# Altium schematic sheet LM5146.SchDoc
size A4; SheetNumber: 2; SheetTotal: 3
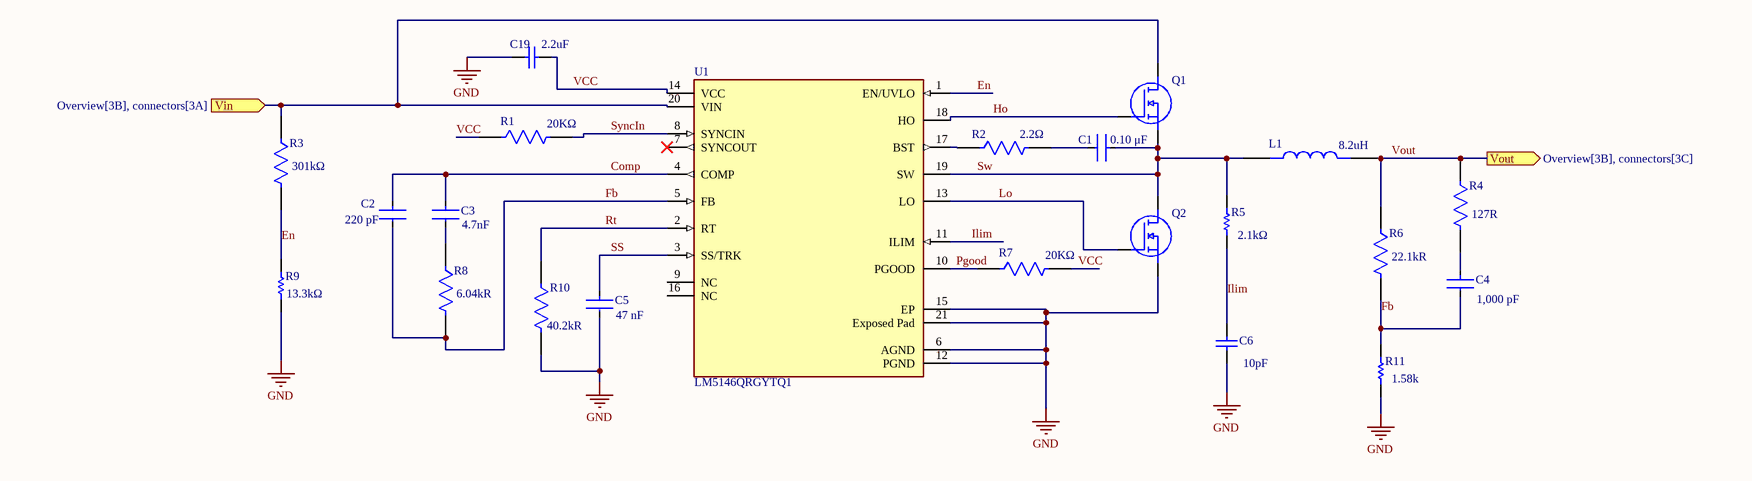
[diagram p0: LM5146.SchDoc]

## Parts
C1  value 0.10 μF  [FP-C0805C-DN-MFG]  (hidden comment: C0805C104K5RACTU)
C2  Capacitance: 220 pF  [FP-CC0805-0_85-MFG]  (hidden comment: CC0805KRX7R9BB221)
C3  Capacitance: 4.7nF  [FP-GRM216-0_1-IPC_C]  (hidden comment: GRM2165C1H472JA01D)
C4  value 1,000 pF  [FP-C0805C-DN-MFG]  (hidden comment: C0805C102J5GACTU)
C5  Capacitance: 47 nF  [FP-C0805C-DN-MFG]  (hidden comment: C0805C473K5RACTU)
C6  capacitance: 10pF  [CAPC2013X88X50ML20T25]  (hidden comment: C0805C100JDGACTU)
C19  Capacitance: 2.2uF  [CAPC2013X135X50ML10T20]  (hidden comment: GRM21BR71A225KA01L)
L1  value 8.2uH  [CPRX3231L-8R2MC]  (hidden comment: CPRX3231L-8R2MC)
Q1  STP130N6F7  [TO255P460X1020X2008-3P]  (value not drawn)
Q2  STP130N6F7  [TO255P460X1020X2008-3P]  (value not drawn)
R1  Resistance: 20KΩ  [FP-RN732A-MFG]  (hidden comment: RN73C2A20KBTDF)
R2  Resistance: 2.2Ω  [FP-RMCF0805-IPC_A]  (hidden comment: RMCF0805JT2R20)
R3  Resistance: 301kΩ  [FP-RMCF0805-IPC_A]  (hidden comment: RMCF0805FT301K)
R4  Resistance: 127R  [FP-CRCW0805-e3-IPC_C]  (hidden comment: CRCW0805127RFKEA)
R5  Resistance: 2.1kΩ  [RESC2013X60X30NL20T20]  (hidden comment: RK73H2ATTD2101F)
R6  Resistance: 22.1kR  [FP-RMCF0805-IPC_B]  (hidden comment: RMCF0805FT22K1)
R7  Resistance: 20KΩ  [FP-RN732A-MFG]  (hidden comment: RN73C2A20KBTDF)
R8  Resistance: 6.04kR  [FP-RMCF0805-IPC_B]  (hidden comment: RMCF0805FT6K04)
R9  Resistance: 13.3kΩ  [RESC2013X60X35ML10T20]  (hidden comment: RC0805FR-0713K3L)
R10  Resistance: 40.2kR  [FP-RMCF0805-IPC_C]  (hidden comment: RMCF0805FT40K2)
R11  Resistance: 1.58k  [RESC2013X60X35LL10T20]  (hidden comment: RC0805FR-071K58L)
U1  LM5146QRGYTQ1  [FP-RGY0020B-MFG]

## Ports
Vin (in, see Overview[3B], connectors[3A]), Vout (out, see Overview[3B], connectors[3C])

## Nets
GND: C5.2 C6.2 C19.1 Q2.3(S) R9.2 R10.2 R11.2 U1.6(AGND) U1.12(PGND) U1.15(EP) U1.21(Exposed_Pad)
Comp: C2.1 C3.2 U1.4(COMP)
En: R3.2 R9.1 U1.1(EN/UVLO)
Fb: C2.2 C4.2 R6.2 R8.2 R11.1 U1.5(FB)
Ho: Q1.1(G) U1.18(HO)
Ilim: C6.1 R5.2 U1.11(ILIM)
Lo: Q2.1(G) U1.13(LO)
Pgood: R7.1 U1.10(PGOOD)
Rt: R10.1 U1.2(RT)
SS: C5.1 U1.3(SS/TRK)
Sw: C1.1 L1.1 Q1.3(S) Q2.2(D) R5.1 U1.19(SW)
SyncIn: R1.2 U1.8(SYNCIN)
VCC: C19.2 R1.1 R7.2 U1.14(VCC)
Vin: Q1.2(D) R3.1 U1.20(VIN) ; port Vin
Vout: L1.2 R4.1 R6.1 ; port Vout
NetC1_2: C1.2 R2.2
NetC3_1: C3.1 R8.1
NetC4_1: C4.1 R4.2
NetR2_1: R2.1 U1.17(BST)

Not connected (* = marked no-connect by the designer): U1 7(SYNCOUT)* 9(NC) 16(NC)

## Library data of the parts
C1 = CMP-2007-00279-2: CAP CER 0.1UF 50V X7R 0805; Manufacturer: KEMET; Description: C0805 0.10 μF X7R 30ppm/°C 10.00% 50 V; Tolerance: 0.1; Temperature Coefficient: 30ppm/°C; Material: Ceramic; Manufacturer Part Number: C0805C104K5RACTU; Device Class L2: Capacitors; Temperature Range Low: -55°C; Voltage Rating: 50 V; Digikey Description: CAP CER 0.1UF 50V X7R 0805; Category: Cap; ComponentLink2Description: Datasheet; Octopart: https://octopart.com/c0805c104k5ractu-kemet-143926; RoHS: TRUE; ComponentLink2URL: https://content.kemet.com/datasheets/KEM_C1003_C0G_SMD.pdf; Temperature Characteristic: X7R; Temperature: -55°C to +125°C; Height: 0.88mm; Temperature Range High: +125°C; Device Class L1: Passive Components; Automotive: No; Lead Free: Yes; Ipc Land Pattern Name: CAPC200125X78; Device Class L3: Ceramic Capacitors; Mouser Description: Cap Ceramic 0.1uF 50V X7R 10% SMD 2.0 x 1.2 mm 125 C Paper T/R; Capacitance: 0.10 μF; Package: C0805C-DN
C2 = CMP-1036-02315-3: CAP CER 220PF 50V X7R 0805; Manufacturer: Yageo; Tolerance: 0.1; Material: Ceramic; Package: CC0805-0.85; Temperature Range High: +85°C; Voltage Rating: 50 V; Automotive: No; Temperature Characteristic: X7R; Value: 220 pF; Octopart: https://octopart.com/cc0805krx7r9bb221-yageo-39467731; Device Class L1: Passive Components; Temperature: -30°C to +85°C; Lead Free: Yes; RoHS: TRUE; Mouser Description: Surface Mount Ceramic Multilayer Capacitor 220pF 10% X7R 50V 0805 Paper T/R; ComponentLink2URL: http://www.yageo.com/documents/recent/UPY-GPHC_Y5V_6.3V-to-50V_8.pdf; Category: Cap; Manufacturer Part Number: CC0805KRX7R9BB221; Ipc Land Pattern Name: CAPC200125X85; Device Class L2: Capacitors; Device Class L3: Ceramic Capacitors; Digikey Description: CAP CER 220PF 50V X7R 0805; Temperature Range Low: -30°C; Height: 0.95mm; Footprint Url: http://www.yageo.com/exep/pages/download/literatures/UPY-C_GEN_24.pdf; ComponentLink2Description: Datasheet
C3 = CMP-1036-03587-2: Chip Multilayer Ceramic Capacitors for General Purpose, 0805, 4700pF, C0G, 30ppm/°C, 5%, 50V; Length: 2mm; Voltage: 50V; Packaging: Tape and Reel; Tolerance: 5%; Temperature Coefficient: 30ppm/°C; REACH SVHC: No SVHC; Material: Ceramic; RoHS Compliant: Yes; Case Code (Imperial): 0805; Number of Pins: 2; Depth: 1.25mm; Termination: SMD/SMT; Voltage Rating (DC): 50V; Thickness: 0.028inch; Max Operating Temperature: 125°C; Min Operating Temperature: -55°C; Height: 0.6mm; Lead Free: Lead Free; Voltage Rating: 50V; Mount: Surface Mount; Case/Package: 0805; Width: 0.049inch; Package Quantity: 1; Dielectric: C0G; Case Code (Metric): 2012
C4 = CMP-2007-00235-2: CAP CER 1000PF 50V C0G/NP0 0805; Manufacturer: KEMET; Temperature Characteristic: C0G; Material: Ceramic; Temperature Coefficient: 30ppm/°C; Tolerance: 0.05; Automotive: No; Voltage Rating: 50 V; Device Class L1: Passive Components; Digikey Description: CAP CER 1000PF 50V C0G/NP0 0805; Lead Free: Yes; Capacitance: 1,000 pF; Package: C0805C-DN; RoHS: TRUE; Temperature Range High: +125°C; Height: 0.88mm; Ipc Land Pattern Name: CAPC200125X78; Category: Cap; ComponentLink2URL: https://content.kemet.com/datasheets/KEM_C1003_C0G_SMD.pdf; Device Class L2: Capacitors; ComponentLink2Description: Datasheet; Temperature: -55°C to +125°C; Octopart: https://octopart.com/c0805c102j5gactu-kemet-97757; Mouser Description: Multilayer Ceramic Capacitors MLCC - SMD/SMT 50volts 1000pF C0G 5%; Manufacturer Part Number: C0805C102J5GACTU; Device Class L3: Ceramic Capacitors; Temperature Range Low: -55°C
C5 = CMP-2007-01098-2: CAP CER 0.047UF 50V X7R 0805; Manufacturer: KEMET; Value: 47,000 pF; Material: Ceramic; Tolerance: 0.1; Temperature Coefficient: 30ppm/°C; Ipc Land Pattern Name: CAPC200125X78; ComponentLink2URL: https://content.kemet.com/datasheets/KEM_C1003_C0G_SMD.pdf; Manufacturer Part Number: C0805C473K5RACTU; ComponentLink2Description: Datasheet; Voltage Rating: 50 V; Device Class L3: Ceramic Capacitors; Temperature Range High: +125°C; Temperature: -55°C to +125°C; RoHS: TRUE; Digikey Description: CAP CER 0.047UF 50V X7R 0805; Octopart: https://octopart.com/c0805c473k5ractu-kemet-138387; Temperature Range Low: -55°C; Height: 0.88mm; Lead Free: Yes; Temperature Characteristic: X7R; Mouser Description: Capacitor; Ceramic; Cap 0.047 uF; Tol 10%; Vol-Rtg 50 VDC; SMT; 0805; X7R; Tape&Reel; Automotive: No; Device Class L1: Passive Components; Device Class L2: Capacitors; Package: C0805C-DN; Category: Cap; Parameter 1: *
C6 = CMP-2007-00220-1: Manufacturer: Kemet; Part Number: C0805C100JDGACTU
C19 = CMP-2007-03454-1: Manufacturer: Murata; Part Number: GRM21BR71A225KA01L
L1 = CPRX3231L-8R2MC: MP: CPEX3231A-330MC; Package: None; Price: None; Availability: Unavailable
Q1 Q2 = STP130N6F7: N-channel 60 V, 4.2 m typ., 80 A STripFET F7 Power MOSFET in a TO-220 package; Manufacturer_Name: STMicroelectronics; Geometry.Height: 4.6mm; Mouser Part Number: 511-STP130N6F7; Mouser Price/Stock: https://www.mouser.co.uk/ProductDetail/STMicroelectronics/STP130N6F7?qs=bKenfurwlsnAlTA32qCHLw%3D%3D; Manufacturer_Part_Number: STP130N6F7; Datasheet Link: https://www.st.com/resource/en/datasheet/stp130n6f7.pdf
R1 R7 = CMP-03211-001671-1: SMD Chip Resistor, Thin Film, 20KΩ, 100 V, 0805 [2012 Metric], 100 mW, 0.1%, RN73 Series; Manufacturer: TE Connectivity; Power Rating: 0.1W; Temperature Coefficient: 10ppm/°C; Voltage Rating: 100V; ComponentLink2URL: https://www.te.com/commerce/DocumentDelivery/DDEController?Action=showdoc&DocId=Data+Sheet%7F1773270%7FP%7Fpdf%7FEnglish%7FENG_DS_1773270_P.pdf%7F1676162-2; RoHS: TRUE; Category: Res; Temperature Range Low: -55°C; octopart_url: https://octopart.com/rn73c2a20kbtdf-te+connectivity-21411984; Value: 20KΩ; Temperature: -55°C to 155°C; Device Class L3: Chip SMD Resistors; Lead Free: Yes; Automotive: No; packaging: 1000 Reel; Device Class L2: Resistors; Octopart: https://octopart.com/rn73c2a20kbtdf-te+connectivity-21411984; Temperature Range High: 155°C; Device Class L1: Passive Components; Height: 0.65mm; ComponentLink2Description: Datasheet; Package: RN732A; Ipc Land Pattern Name: RESC200125X55; Composition: Thin Film; Series: RN73; Tolerance: 0.1%; Manufacturer Part Number: RN73C2A20KBTDF
R2 = CMP-26527-001415-1: 2.2Ω ±5% 0.125W 0805 Thick Film Chip Resistor AEC-Q200 compliant; Max Power Dissipation: 125mW; Temperature Coefficient: 200ppm/°C; Case Code (Imperial): 0805; Length: 0.079inch; Resistor Type: Thick Film; Case/Package: 0805; Contact Plating: Tin; Width: 0.049inch; Features: Automotive AEC-Q200; Tolerance: 5%; Max Operating Temperature: 155°C; Series: RMCF; Number of Terminations: 2; Case Code (Metric): 2012; RoHS Compliant: Yes; Packaging: Tape and Reel; Min Operating Temperature: -55°C; Radiation Hardening: No; Mount: Surface Mount; Lead Free: Lead Free; Height: 0.026inch
R3 = CMP-26527-003666-1: 301kΩ ±1% 0.125W 0805 Thick Film Chip Resistor AEC-Q200 compliant; Max Power Dissipation: 125mW; Temperature Coefficient: 100ppm/°C; Packaging: Tape and Reel; Military Standard: Not; Features: Automotive AEC-Q200; Resistor Type: Thick Film; Width: 0.049inch; Series: RMCF; Construction: Rectangular; RoHS Compliant: Yes; Case Code (Imperial): 0805; Number of Terminations: 2; Mount: Surface Mount; Height: 0.026inch; Case/Package: 0805; Radiation Hardening: No; Max Operating Temperature: 155°C; Depth: 1.25mm; Min Operating Temperature: -55°C; Tolerance: 1%; Length: 0.079inch; Lead Free: Lead Free; Contact Plating: Tin; Case Code (Metric): 2012
R4 = CMP-1013-00408-3: RES Thick Film, 127Ω, 1%, 0.125W, 100ppm/°C, 0805; Power Rating: 125mW; Voltage Rating (DC): 150V; Number of Pins: 2; Series: CRCW; Width: 0.049inch; Lead Free: Lead Free; Resistance Tolerance: 1%; Max Operating Temperature: 155°C; Tolerance: 1%; Military Standard: Not; Contact Plating: Tin; Temperature Coefficient: 100ppm/°C; Packaging: Tape and Reel; Case Code (Metric): 2012; Max Power Dissipation: 125mW; Features: Automotive AEC-Q200; Depth: 1.25mm; Package Quantity: 10; Case/Package: 0805; Termination: SMD/SMT; Number of Terminations: 2; Radiation Hardening: No; Weight: 0.000194oz; Height: 0.02inch; Length: 2mm; Voltage Rating: 150V; Construction: Rectangular; Resistor Type: Thick Film; Case Code (Imperial): 0805; RoHS Compliant: Yes; Min Operating Temperature: -55°C
R5 = CMP-2001-02195-1: Manufacturer: KOA Speer; Part Number: RK73H2ATTD2101F
R6 = CMP-26527-001411-1: 22.1kΩ ±1% 0.125W 0805 Thick Film Chip Resistor AEC-Q200 compliant; Temperature Coefficient: 100ppm/°C; Power Rating: 125mW; Min Operating Temperature: -55°C; Size Code: 0805; Max Operating Temperature: 155°C; Military Standard: Not; Features: Automotive AEC-Q200; Lead Free: Lead Free; Contact Plating: Tin; Tolerance: 1%; Series: RMCF; Resistor Type: Thick Film; Width: 0.049inch; Case Code (Imperial): 0805; Case/Package: 0805; Depth: 1.25mm; Mount: Surface Mount; RoHS Compliant: Yes; Max Power Dissipation: 125mW; Case Code (Metric): 2012; Height: 0.026inch; Construction: Rectangular; Number of Terminations: 2; Packaging: Tape and Reel; Radiation Hardening: No; Length: 0.079inch
R8 = CMP-26527-005687-1: 6.04kΩ ±1% 0.125W 0805 Thick Film Chip Resistor AEC-Q200 compliant; Temperature Coefficient: 100ppm/°C; Max Power Dissipation: 125mW; RoHS Compliant: Yes; Packaging: Tape and Reel; Lead Free: Lead Free; Length: 0.079inch; Width: 0.049inch; Min Operating Temperature: -55°C; Number of Terminations: 2; Case/Package: 0805; Series: RMCF; Contact Plating: Tin; Depth: 1.25mm; Resistor Type: Thick Film; Case Code (Imperial): 0805; Tolerance: 1%; Radiation Hardening: No; Case Code (Metric): 2012; Military Standard: Not; Power Rating: 125mW; Mount: Surface Mount; Max Operating Temperature: 155°C; Construction: Rectangular; Size Code: 0805; Features: Automotive AEC-Q200; Height: 0.026inch
R9 = CMP-2001-00918-1: Manufacturer: Yageo; Part Number: RC0805FR-0713K3L
R10 = CMP-26527-006371-1: 40.2kΩ ±1% 0.125W 0805 Thick Film Chip Resistor AEC-Q200 compliant; Max Power Dissipation: 125mW; Temperature Coefficient: 100ppm/°C; Packaging: Tape and Reel; Width: 0.049inch; Case Code (Metric): 2012; Mount: Surface Mount; Case/Package: 0805; Min Operating Temperature: -55°C; Features: Automotive AEC-Q200; Contact Plating: Tin; Height: 0.026inch; Tolerance: 1%; Construction: Rectangular; Depth: 1.25mm; Case Code (Imperial): 0805; RoHS Compliant: Yes; Military Standard: Not; Number of Terminations: 2; Size Code: 0805; Max Operating Temperature: 155°C; Resistor Type: Thick Film; Series: RMCF; Lead Free: Lead Free; Length: 2mm; Power Rating: 125mW; Radiation Hardening: No
R11 = CMP-2001-00963-1: Manufacturer: Yageo; Part Number: RC0805FR-071K58L
U1 = CMP-04918-000302-1: IC REG BUCK ADJ 3.5A 20VQFN; RoHS Compliant: Yes